# Altium schematic sheet FMC.SchDoc: FPGA Peripherals Board - FMC
size A3; Author: mayerph; DrawnBy: mayerph; Organization: IIS; Revision: PA; SheetNumber: 2; SheetTotal: 7
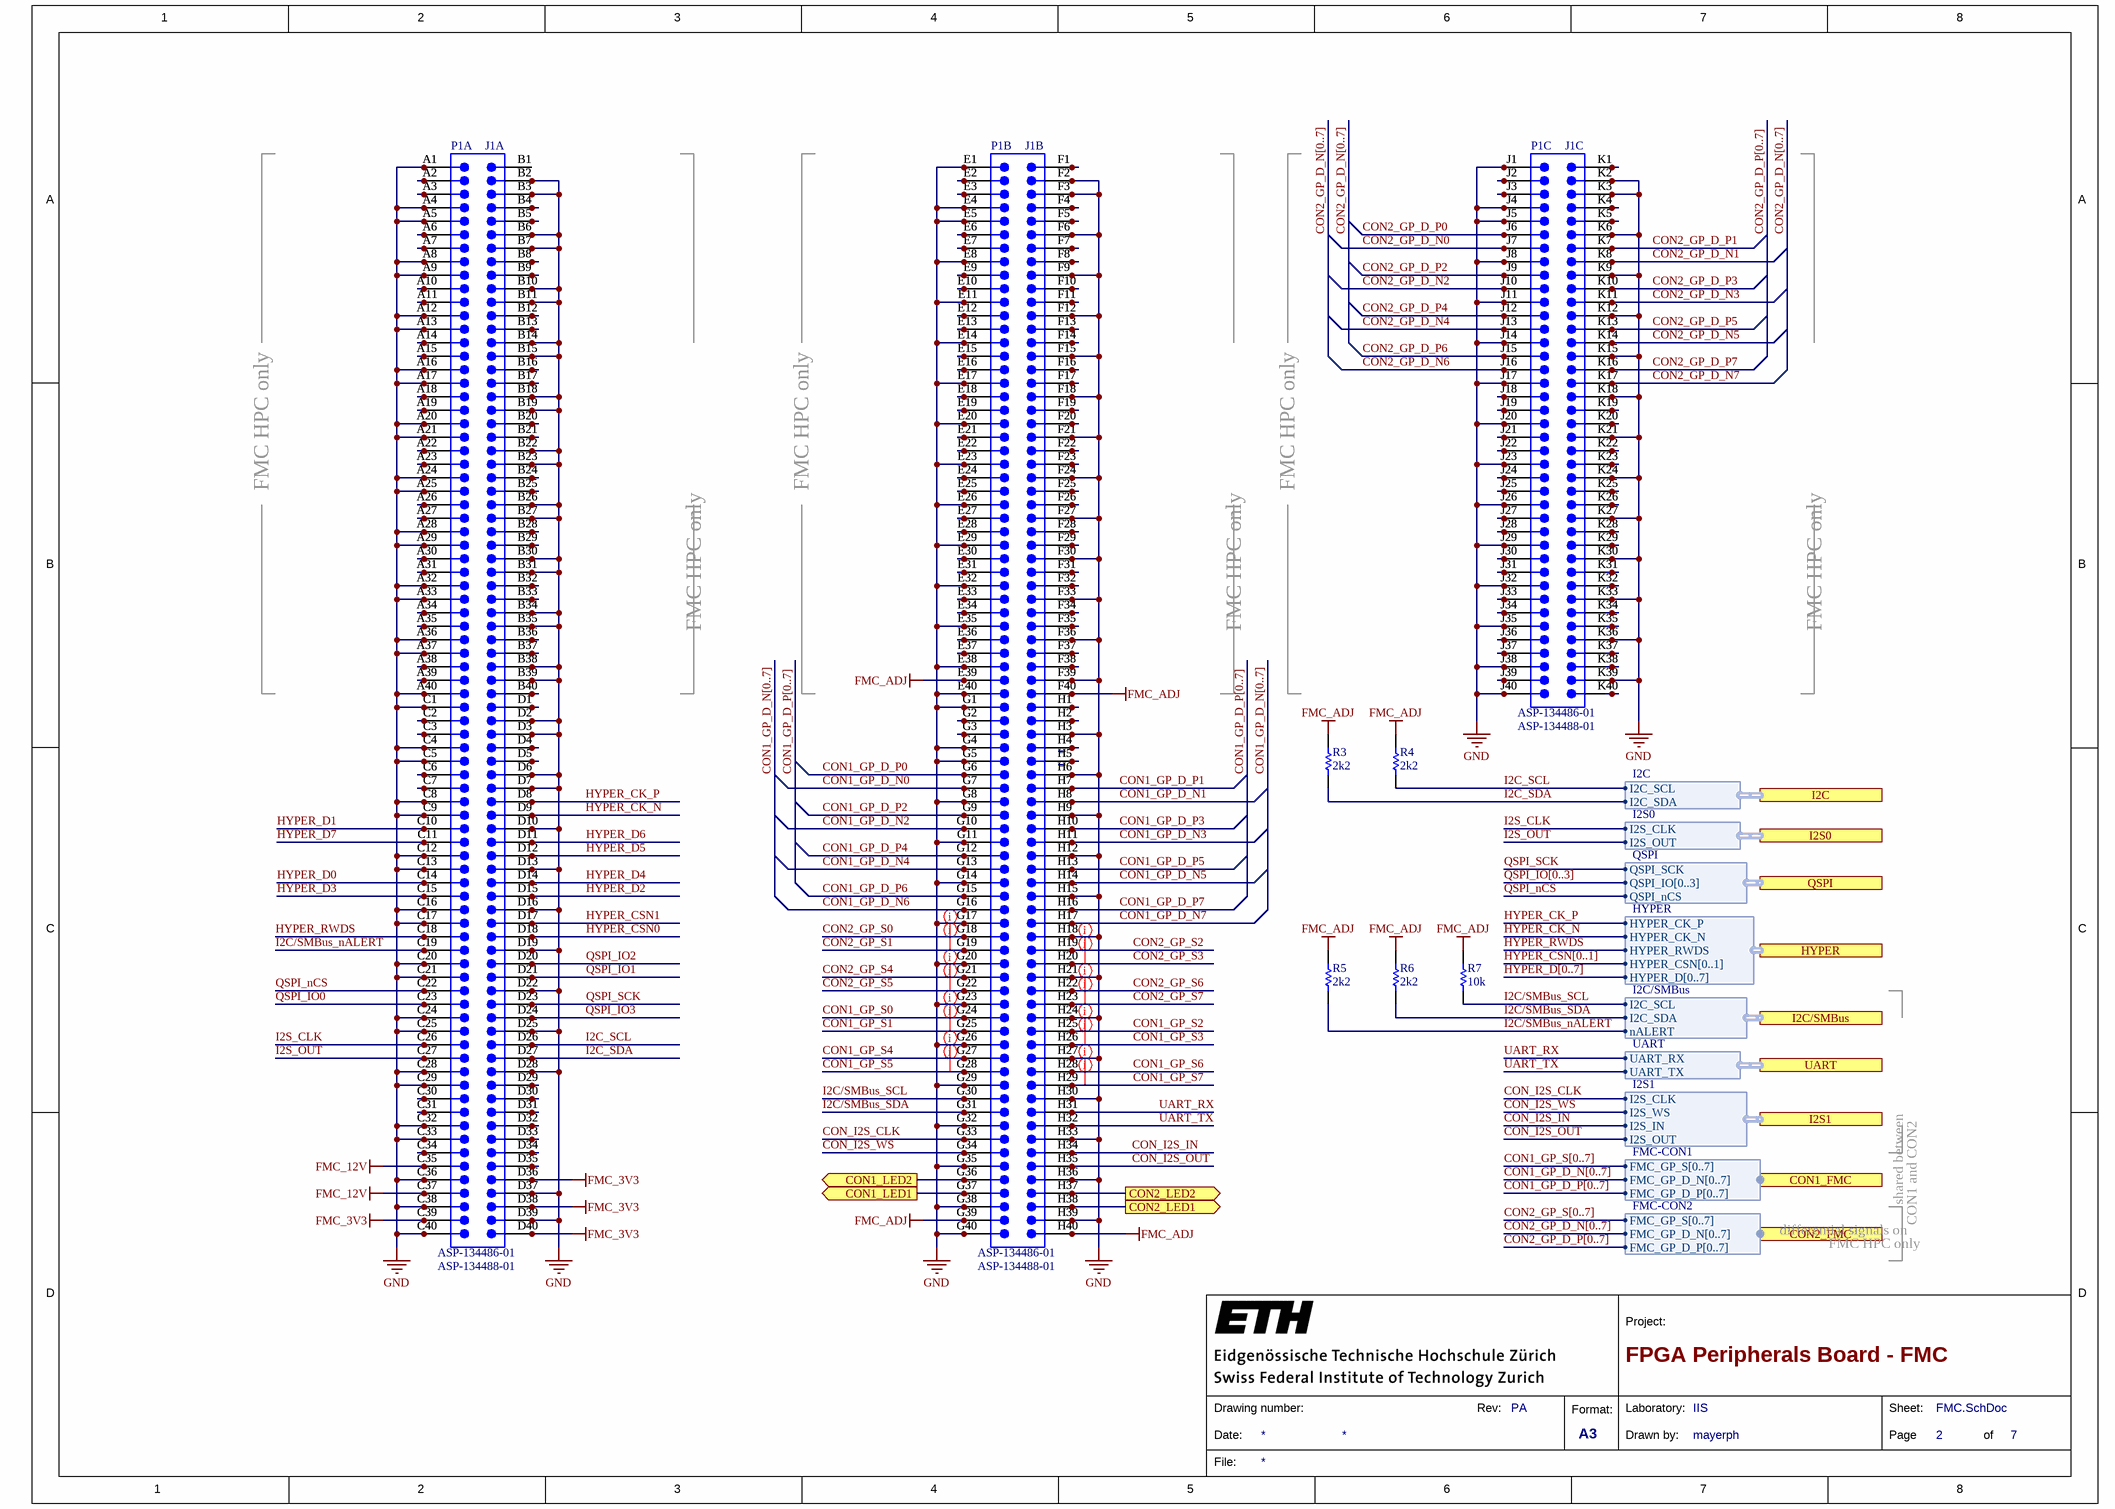
[diagram p0: FMC.SchDoc]

## Parts
J1  ASP-134486-01  [BTB-SM1-27-2V400F]  (parts A,B,C of 3)
P1  ASP-134488-01  [BTB-SM1-27-2V400M]  (parts A,B,C of 3)
R3  2k2  [RESC1005X40X25LL05T10]
R4  2k2  [RESC1005X40X25LL05T10]
R5  2k2  [RESC1005X40X25LL05T10]
R6  2k2  [RESC1005X40X25LL05T10]
R7  10k  [RESC1005X40X25LL05T10]

## Ports
CON1_FMC (harness FMC-CON1), CON1_LED1 (out), CON1_LED2 (out), CON2_FMC (harness FMC-CON2), CON2_LED1 (out), CON2_LED2 (out), HYPER (harness HYPER), I2C (harness I2C), I2C/SMBus (harness I2C/SMBus), I2S0 (harness I2S0), I2S1 (harness I2S1), QSPI (harness QSPI), UART (harness UART)

## Harnesses
I2C/SMBus: I2C_SDA, I2C_SCL, nALERT
UART: UART_TX, UART_RX
I2S1: I2S_OUT, I2S_IN, I2S_WS, I2S_CLK
FMC-CON1: FMC_GP_D_N[0..7], FMC_GP_S[0..7], FMC_GP_D_P[0..7]
I2S0: I2S_OUT, I2S_CLK
I2C: I2C_SDA, I2C_SCL
QSPI: QSPI_SCK, QSPI_IO[0..3], QSPI_nCS
HYPER: HYPER_CK_N, HYPER_CK_P, HYPER_RWDS, HYPER_CSN[0..1], HYPER_D[0..7]
FMC-CON2: FMC_GP_D_N[0..7], FMC_GP_S[0..7], FMC_GP_D_P[0..7]

## Nets
FMC_3V3: J1.C39 J1.D36 J1.D38 J1.D40 P1.C39 P1.D36 P1.D38 P1.D40
FMC_12V: J1.C35 J1.C37 P1.C35 P1.C37
FMC_ADJ: J1.E39 J1.F40 J1.G39 J1.H40 P1.E39 P1.F40 P1.G39 P1.H40 R3.2 R4.2 R5.2 R6.2 R7.2
GND: J1.A1 J1.A4 J1.A5 J1.A8 J1.A9 J1.A12 J1.A13 J1.A16 J1.A17 J1.A20 J1.A21 J1.A24 J1.A25 J1.A28 J1.A29 J1.A32 J1.A33 J1.A36 J1.A37 J1.A40 J1.B2 J1.B3 J1.B6 J1.B7 J1.B10 J1.B11 J1.B14 J1.B15 J1.B18 J1.B19 J1.B22 J1.B23 J1.B26 J1.B27 J1.B30 J1.B31 J1.B34 J1.B35 J1.B38 J1.B39 J1.C1 J1.C4 J1.C5 J1.C8 J1.C9 J1.C12 J1.C13 J1.C16 J1.C17 J1.C20 J1.C21 J1.C24 J1.C25 J1.C28 J1.C29 J1.C32 J1.C33 J1.C36 J1.C38 J1.C40 J1.D2 J1.D3 J1.D6 J1.D7 J1.D10 J1.D13 J1.D16 J1.D19 J1.D22 J1.D25 J1.D28 J1.D37 J1.D39 J1.E1 J1.E4 J1.E5 J1.E8 J1.E11 J1.E14 J1.E17 J1.E20 J1.E23 J1.E26 J1.E29 J1.E32 J1.E35 J1.E38 J1.E40 J1.F2 J1.F3 J1.F6 J1.F9 J1.F12 J1.F15 J1.F18 J1.F21 J1.F24 J1.F27 J1.F30 J1.F33 J1.F36 J1.F39 J1.G1 J1.G4 J1.G5 J1.G8 J1.G11 J1.G14 J1.G17 J1.G20 J1.G23 J1.G26 J1.G29 J1.G32 J1.G35 J1.G38 J1.G40 J1.H3 J1.H6 J1.H9 J1.H12 J1.H15 J1.H18 J1.H21 J1.H24 J1.H27 J1.H30 J1.H33 J1.H36 J1.H39 J1.J1 J1.J4 J1.J5 J1.J8 J1.J11 J1.J14 J1.J17 J1.J20 J1.J23 J1.J26 J1.J29 J1.J32 J1.J35 J1.J38 J1.J40 J1.K2 J1.K3 J1.K6 J1.K9 J1.K12 J1.K15 J1.K18 J1.K21 J1.K24 J1.K27 J1.K30 J1.K33 J1.K36 J1.K39 P1.A1 P1.A4 P1.A5 P1.A8 P1.A9 P1.A12 P1.A13 P1.A16 P1.A17 P1.A20 P1.A21 P1.A24 P1.A25 P1.A28 P1.A29 P1.A32 P1.A33 P1.A36 P1.A37 P1.A40 P1.B2 P1.B3 P1.B6 P1.B7 P1.B10 P1.B11 P1.B14 P1.B15 P1.B18 P1.B19 P1.B22 P1.B23 P1.B26 P1.B27 P1.B30 P1.B31 P1.B34 P1.B35 P1.B38 P1.B39 P1.C1 P1.C4 P1.C5 P1.C8 P1.C9 P1.C12 P1.C13 P1.C16 P1.C17 P1.C20 P1.C21 P1.C24 P1.C25 P1.C28 P1.C29 P1.C32 P1.C33 P1.C36 P1.C38 P1.C40 P1.D2 P1.D3 P1.D6 P1.D7 P1.D10 P1.D13 P1.D16 P1.D19 P1.D22 P1.D25 P1.D28 P1.D37 P1.D39 P1.E1 P1.E4 P1.E5 P1.E8 P1.E11 P1.E14 P1.E17 P1.E20 P1.E23 P1.E26 P1.E29 P1.E32 P1.E35 P1.E38 P1.E40 P1.F2 P1.F3 P1.F6 P1.F9 P1.F12 P1.F15 P1.F18 P1.F21 P1.F24 P1.F27 P1.F30 P1.F33 P1.F36 P1.F39 P1.G1 P1.G4 P1.G5 P1.G8 P1.G11 P1.G14 P1.G17 P1.G20 P1.G23 P1.G26 P1.G29 P1.G32 P1.G35 P1.G38 P1.G40 P1.H3 P1.H6 P1.H9 P1.H12 P1.H15 P1.H18 P1.H21 P1.H24 P1.H27 P1.H30 P1.H33 P1.H36 P1.H39 P1.J1 P1.J4 P1.J5 P1.J8 P1.J11 P1.J14 P1.J17 P1.J20 P1.J23 P1.J26 P1.J29 P1.J32 P1.J35 P1.J38 P1.J40 P1.K2 P1.K3 P1.K6 P1.K9 P1.K12 P1.K15 P1.K18 P1.K21 P1.K24 P1.K27 P1.K30 P1.K33 P1.K36 P1.K39
CON1_GP_D_N0: J1.G7 P1.G7
CON1_GP_D_N1: J1.H8 P1.H8
CON1_GP_D_N2: J1.G10 P1.G10
CON1_GP_D_N3: J1.H11 P1.H11
CON1_GP_D_N4: J1.G13 P1.G13
CON1_GP_D_N5: J1.H14 P1.H14
CON1_GP_D_N6: J1.G16 P1.G16
CON1_GP_D_N7: J1.H17 P1.H17
CON1_GP_D_P0: J1.G6 P1.G6
CON1_GP_D_P1: J1.H7 P1.H7
CON1_GP_D_P2: J1.G9 P1.G9
CON1_GP_D_P3: J1.H10 P1.H10
CON1_GP_D_P4: J1.G12 P1.G12
CON1_GP_D_P5: J1.H13 P1.H13
CON1_GP_D_P6: J1.G15 P1.G15
CON1_GP_D_P7: J1.H16 P1.H16
CON1_GP_S0: J1.G24 P1.G24
CON1_GP_S1: J1.G25 P1.G25
CON1_GP_S2: J1.H25 P1.H25
CON1_GP_S3: J1.H26 P1.H26
CON1_GP_S4: J1.G27 P1.G27
CON1_GP_S5: J1.G28 P1.G28
CON1_GP_S6: J1.H28 P1.H28
CON1_GP_S7: J1.H29 P1.H29
CON1_LED1: J1.G37 P1.G37 ; port CON1_LED1
CON1_LED2: J1.G36 P1.G36 ; port CON1_LED2
CON2_GP_D_N0: J1.J7 P1.J7
CON2_GP_D_N1: J1.K8 P1.K8
CON2_GP_D_N2: J1.J10 P1.J10
CON2_GP_D_N3: J1.K11 P1.K11
CON2_GP_D_N4: J1.J13 P1.J13
CON2_GP_D_N5: J1.K14 P1.K14
CON2_GP_D_N6: J1.J16 P1.J16
CON2_GP_D_N7: J1.K17 P1.K17
CON2_GP_D_P0: J1.J6 P1.J6
CON2_GP_D_P1: J1.K7 P1.K7
CON2_GP_D_P2: J1.J9 P1.J9
CON2_GP_D_P3: J1.K10 P1.K10
CON2_GP_D_P4: J1.J12 P1.J12
CON2_GP_D_P5: J1.K13 P1.K13
CON2_GP_D_P6: J1.J15 P1.J15
CON2_GP_D_P7: J1.K16 P1.K16
CON2_GP_S0: J1.G18 P1.G18
CON2_GP_S1: J1.G19 P1.G19
CON2_GP_S2: J1.H19 P1.H19
CON2_GP_S3: J1.H20 P1.H20
CON2_GP_S4: J1.G21 P1.G21
CON2_GP_S5: J1.G22 P1.G22
CON2_GP_S6: J1.H22 P1.H22
CON2_GP_S7: J1.H23 P1.H23
CON2_LED1: J1.H38 P1.H38 ; port CON2_LED1
CON2_LED2: J1.H37 P1.H37 ; port CON2_LED2
CON_I2S_CLK: J1.G33 P1.G33 ; port I2S1.I2S_CLK
CON_I2S_IN: J1.H34 P1.H34 ; port I2S1.I2S_IN
CON_I2S_OUT: J1.H35 P1.H35 ; port I2S1.I2S_OUT
CON_I2S_WS: J1.G34 P1.G34 ; port I2S1.I2S_WS
HYPER_CK_N: J1.D9 P1.D9 ; port HYPER.HYPER_CK_N
HYPER_CK_P: J1.D8 P1.D8 ; port HYPER.HYPER_CK_P
HYPER_CSN0: J1.D18 P1.D18
HYPER_CSN1: J1.D17 P1.D17
HYPER_D0: J1.C14 P1.C14
HYPER_D1: J1.C10 P1.C10
HYPER_D2: J1.D15 P1.D15
HYPER_D3: J1.C15 P1.C15
HYPER_D4: J1.D14 P1.D14
HYPER_D5: J1.D12 P1.D12
HYPER_D6: J1.D11 P1.D11
HYPER_D7: J1.C11 P1.C11
HYPER_RWDS: J1.C18 P1.C18 ; port HYPER.HYPER_RWDS
I2C/SMBus_nALERT: J1.C19 P1.C19 R5.1 ; port I2C/SMBus.nALERT
I2C/SMBus_SCL: J1.G30 P1.G30 R7.1 ; port I2C/SMBus.I2C_SCL
I2C/SMBus_SDA: J1.G31 P1.G31 R6.1 ; port I2C/SMBus.I2C_SDA
I2C_SCL: J1.D26 P1.D26 R4.1 ; port I2C.I2C_SCL
I2C_SDA: J1.D27 P1.D27 R3.1 ; port I2C.I2C_SDA
I2S_CLK: J1.C26 P1.C26 ; port I2S0.I2S_CLK
I2S_OUT: J1.C27 P1.C27 ; port I2S0.I2S_OUT
QSPI_IO0: J1.C23 P1.C23
QSPI_IO1: J1.D21 P1.D21
QSPI_IO2: J1.D20 P1.D20
QSPI_IO3: J1.D24 P1.D24
QSPI_nCS: J1.C22 P1.C22 ; port QSPI.QSPI_nCS
QSPI_SCK: J1.D23 P1.D23 ; port QSPI.QSPI_SCK
UART_RX: J1.H31 P1.H31 ; port UART.UART_RX
UART_TX: J1.H32 P1.H32 ; port UART.UART_TX
NetJ1_A2: J1.A2 P1.A2
NetJ1_A3: J1.A3 P1.A3
NetJ1_A6: J1.A6 P1.A6
NetJ1_A7: J1.A7 P1.A7
NetJ1_A10: J1.A10 P1.A10
NetJ1_A11: J1.A11 P1.A11
NetJ1_A14: J1.A14 P1.A14
NetJ1_A15: J1.A15 P1.A15
NetJ1_A18: J1.A18 P1.A18
NetJ1_A19: J1.A19 P1.A19
NetJ1_A22: J1.A22 P1.A22
NetJ1_A23: J1.A23 P1.A23
NetJ1_A26: J1.A26 P1.A26
NetJ1_A27: J1.A27 P1.A27
NetJ1_A30: J1.A30 P1.A30
NetJ1_A31: J1.A31 P1.A31
NetJ1_A34: J1.A34 P1.A34
NetJ1_A35: J1.A35 P1.A35
NetJ1_A38: J1.A38 P1.A38
NetJ1_A39: J1.A39 P1.A39
NetJ1_B1: J1.B1 P1.B1
NetJ1_B4: J1.B4 P1.B4
NetJ1_B5: J1.B5 P1.B5
NetJ1_B8: J1.B8 P1.B8
NetJ1_B9: J1.B9 P1.B9
NetJ1_B12: J1.B12 P1.B12
NetJ1_B13: J1.B13 P1.B13
NetJ1_B16: J1.B16 P1.B16
NetJ1_B17: J1.B17 P1.B17
NetJ1_B20: J1.B20 P1.B20
NetJ1_B21: J1.B21 P1.B21
NetJ1_B24: J1.B24 P1.B24
NetJ1_B25: J1.B25 P1.B25
NetJ1_B28: J1.B28 P1.B28
NetJ1_B29: J1.B29 P1.B29
NetJ1_B32: J1.B32 P1.B32
NetJ1_B33: J1.B33 P1.B33
NetJ1_B36: J1.B36 P1.B36
NetJ1_B37: J1.B37 P1.B37
NetJ1_B40: J1.B40 P1.B40
NetJ1_C2: J1.C2 P1.C2
NetJ1_C3: J1.C3 P1.C3
NetJ1_C6: J1.C6 P1.C6
NetJ1_C7: J1.C7 P1.C7
NetJ1_C30: J1.C30 P1.C30
NetJ1_C31: J1.C31 P1.C31
NetJ1_C34: J1.C34 P1.C34
NetJ1_D1: J1.D1 P1.D1
NetJ1_D4: J1.D4 P1.D4
NetJ1_D5: J1.D5 P1.D5
NetJ1_D29: J1.D29 P1.D29
NetJ1_D30: J1.D30 P1.D30
NetJ1_D31: J1.D31 P1.D31
NetJ1_D32: J1.D32 P1.D32
NetJ1_D33: J1.D33 P1.D33
NetJ1_D34: J1.D34 P1.D34
NetJ1_D35: J1.D35 P1.D35
NetJ1_E2: J1.E2 P1.E2
NetJ1_E3: J1.E3 P1.E3
NetJ1_E6: J1.E6 P1.E6
NetJ1_E7: J1.E7 P1.E7
NetJ1_E9: J1.E9 P1.E9
NetJ1_E10: J1.E10 P1.E10
NetJ1_E12: J1.E12 P1.E12
NetJ1_E13: J1.E13 P1.E13
NetJ1_E15: J1.E15 P1.E15
NetJ1_E16: J1.E16 P1.E16
NetJ1_E18: J1.E18 P1.E18
NetJ1_E19: J1.E19 P1.E19
NetJ1_E21: J1.E21 P1.E21
NetJ1_E22: J1.E22 P1.E22
NetJ1_E24: J1.E24 P1.E24
NetJ1_E25: J1.E25 P1.E25
NetJ1_E27: J1.E27 P1.E27
NetJ1_E28: J1.E28 P1.E28
NetJ1_E30: J1.E30 P1.E30
NetJ1_E31: J1.E31 P1.E31
NetJ1_E33: J1.E33 P1.E33
NetJ1_E34: J1.E34 P1.E34
NetJ1_E36: J1.E36 P1.E36
NetJ1_E37: J1.E37 P1.E37
NetJ1_F1: J1.F1 P1.F1
NetJ1_F4: J1.F4 P1.F4
NetJ1_F5: J1.F5 P1.F5
NetJ1_F7: J1.F7 P1.F7
NetJ1_F8: J1.F8 P1.F8
NetJ1_F10: J1.F10 P1.F10
NetJ1_F11: J1.F11 P1.F11
NetJ1_F13: J1.F13 P1.F13
NetJ1_F14: J1.F14 P1.F14
NetJ1_F16: J1.F16 P1.F16
NetJ1_F17: J1.F17 P1.F17
NetJ1_F19: J1.F19 P1.F19
NetJ1_F20: J1.F20 P1.F20
NetJ1_F22: J1.F22 P1.F22
NetJ1_F23: J1.F23 P1.F23
NetJ1_F25: J1.F25 P1.F25
NetJ1_F26: J1.F26 P1.F26
NetJ1_F28: J1.F28 P1.F28
NetJ1_F29: J1.F29 P1.F29
NetJ1_F31: J1.F31 P1.F31
NetJ1_F32: J1.F32 P1.F32
NetJ1_F34: J1.F34 P1.F34
NetJ1_F35: J1.F35 P1.F35
NetJ1_F37: J1.F37 P1.F37
NetJ1_F38: J1.F38 P1.F38
NetJ1_G2: J1.G2 P1.G2
NetJ1_G3: J1.G3 P1.G3
NetJ1_H1: J1.H1 P1.H1
NetJ1_H2: J1.H2 P1.H2
NetJ1_H4: J1.H4 P1.H4
NetJ1_H5: J1.H5 P1.H5
NetJ1_J2: J1.J2 P1.J2
NetJ1_J3: J1.J3 P1.J3
NetJ1_J18: J1.J18 P1.J18
NetJ1_J19: J1.J19 P1.J19
NetJ1_J21: J1.J21 P1.J21
NetJ1_J22: J1.J22 P1.J22
NetJ1_J24: J1.J24 P1.J24
NetJ1_J25: J1.J25 P1.J25
NetJ1_J27: J1.J27 P1.J27
NetJ1_J28: J1.J28 P1.J28
NetJ1_J30: J1.J30 P1.J30
NetJ1_J31: J1.J31 P1.J31
NetJ1_J33: J1.J33 P1.J33
NetJ1_J34: J1.J34 P1.J34
NetJ1_J36: J1.J36 P1.J36
NetJ1_J37: J1.J37 P1.J37
NetJ1_J39: J1.J39 P1.J39
NetJ1_K1: J1.K1 P1.K1
NetJ1_K4: J1.K4 P1.K4
NetJ1_K5: J1.K5 P1.K5
NetJ1_K19: J1.K19 P1.K19
NetJ1_K20: J1.K20 P1.K20
NetJ1_K22: J1.K22 P1.K22
NetJ1_K23: J1.K23 P1.K23
NetJ1_K25: J1.K25 P1.K25
NetJ1_K26: J1.K26 P1.K26
NetJ1_K28: J1.K28 P1.K28
NetJ1_K29: J1.K29 P1.K29
NetJ1_K31: J1.K31 P1.K31
NetJ1_K32: J1.K32 P1.K32
NetJ1_K34: J1.K34 P1.K34
NetJ1_K35: J1.K35 P1.K35
NetJ1_K37: J1.K37 P1.K37
NetJ1_K38: J1.K38 P1.K38
NetJ1_K40: J1.K40 P1.K40

## Buses and harness runs
bus CON1_GP_D_N[0..7]
bus CON1_GP_D_P[0..7]
bus CON1_GP_S[0..7]
bus CON2_GP_D_N[0..7]
bus CON2_GP_D_P[0..7]
bus CON2_GP_S[0..7]
bus HYPER_CSN[0..1]
bus HYPER_D[0..7]
bus QSPI_IO[0..3]

## Layout directives
net class S_FMC_MPP_CON2: CON2_GP_S0, CON2_GP_S1, CON2_GP_S2, CON2_GP_S3, CON2_GP_S4, CON2_GP_S5, CON2_GP_S6, CON2_GP_S7
net class S_FMC_MPP_CON1: CON1_GP_S0, CON1_GP_S1, CON1_GP_S2, CON1_GP_S3, CON1_GP_S4, CON1_GP_S5, CON1_GP_S6, CON1_GP_S7

## Notes on the sheet
- FMC HPC only
- shared between
- CON1 and CON2
- differential signals on
- 1
- 2
- 3
- 4
- 5
- 6
- 7
- 8
- A
- B
- C
- D
- Project:
- Date:
- Drawing number:
- Rev:
- Format:
- A3
- Drawn by:
- Laboratory:
- Page
- Sheet:
- of
- File:

## Library data of the parts
J1 = CMP-0001-00082-1: Board-to-Board Connector, Vertical, 10-Row, Pitch 1.27mm, 400-Position, Female; Manufacturer: Samtec; Mating Connector: ASP-134488-01; Description: SAMTEC - ASP-134486-01 - Board-To-Board Connector, Vita 57 XMC, 1.27 mm, 400 Contacts, Receptacle, ASP Series, Surface Mount; Number of Contacts: 400; Gender: Receptacle; Publisher: Altium; Component Kind: Standard; Package Reference: BTB-SM1-27-2V400F; Datasheet Version: May-2008; ClassName: Board Template Connector; PartId: 1; Supplier 1: Digi-Key; Supplier Part Number 1: SAM8728CT-ND; Manufacturer Part Number: ASP-134486-01; RoHS: Yes; Category: Board to Board Connectors; Stock 1: 2693; Pricing 1: 1=27.42000, 10=24.74900, 25=23.71200, 50=22.23000, 100=21.48900 (USD); Mount: Surface Mount; Contact Plating: Gold; Contact Material: Copper Alloy; Housing Color: Black; Number of Rows: 10; Packaging: Tape and Reel; Termination: Solder; Number of Positions: 400; Orientation: Straight; Series: ASP; Pitch: 1.27mm; Depth: 13.23mm; Radiation Hardening: No; REACH SVHC: No SVHC; RoHS Compliant: Yes; ComponentLink1URL: https://datasheet.ciiva.com/26877/getdatasheetpartid-699855-26877302.pdf?src-supplier=Verical; ComponentLink1Description: https://datasheet.ciiva.com/26877/getdatasheetpartid-699855-26877302.pdf?src-supplier=Verical
P1 = CMP-0001-00022-1: Board-to-Board Connector, Vertical, 10-Row, Pitch 1.27mm, 400-Position; Manufacturer: Samtec; Mating Connector: ASP-134486-01; Description: SAMTEC - ASP-134488-01 - Board-To-Board Connector, 1.27 mm, 400 Contacts, Header, ASP Series, Surface Mount, 10 Rows; Number of Contacts: 400; Gender: Male; Pitch: 0.05inch; Publisher: Altium; ClassName: Board Template Connector; Component Kind: Standard; Datasheet Version: Feb-2007; Package Reference: BTB-SM1-27-2V400M; PartId: 1; Supplier 1: Digi-Key; Supplier Part Number 1: SAM8730-ND; Manufacturer Part Number: ASP-134488-01; RoHS: Yes; Category: Connectors; Stock 1: 4276; Pricing 1: 1=27.73000, 10=25.03300, 25=23.98400, 50=22.48500, 100=21.73550, 250=20.53632, 500=19.93670, 1000=19.48700 (USD); Mount: Surface Mount; Contact Plating: Gold; Contact Material: Copper Alloy; Number of Rows: 10; Termination: SMD/SMT; Packaging: Tape and Reel; Number of Positions: 400; Series: ASP; Package Quantity: 1; Radiation Hardening: No; REACH SVHC: No SVHC; RoHS Compliant: Yes; ComponentLink1URL: https://datasheet.ciiva.com/403/asp-134488-01-403749.pdf?src-supplier=Digi-Key; ComponentLink1Description: https://datasheet.ciiva.com/403/asp-134488-01-403749.pdf?src-supplier=Digi-Key; ComponentLink2URL: https://datasheet.ciiva.com/9532/asp-134488-01-9532666.pdf?src-supplier=Avnet; ComponentLink2Description: https://datasheet.ciiva.com/9532/asp-134488-01-9532666.pdf?src-supplier=Avnet
R3-R6 = CMP-2002-07567-1: Manufacturer: Yageo / Phycomp; Part Number: RC0402FR-072K2L; Value: 2.2 kOhm; Tolerance: 1%; Temperature Coefficient: 100ppm/°C; Max Power Dissipation: 63mW; Voltage Rating: 50V; Supplier 1: Digi-Key; Supplier Part Number 1: 311-2.20KLRCT-ND; Manufacturer Part Number: RC0402FR-072K2L; RoHS: Yes; Category: Chip SMD Resistors; Stock 1: 3865260; Pricing 1: 1=0.10000, 10=0.01400, 100=0.00580, 1000=0.00260, 2500=0.00226, 5000=0.00186 (USD); Case/Package: 0402; Case Code (Imperial): 0402; Case Code (Metric): 1005; Weight: 2.3E-05oz; Size Code: 0402; Min Operating Temperature: -55°C; Max Operating Temperature: 155°C; Packaging: Tape and Reel; Resistor Type: Thick Film; Series: RC; Power Rating: 63mW; Number of Terminations: 2; Termination: SMD/SMT; Resistance Tolerance: 1%; Features: Moisture Resistant; Construction: Rectangular; Technology: THICK FILM; Length: 1mm; Width: 0.5mm; Height: 0.35mm; Depth: 0.5mm; RoHS Compliant: Yes; REACH SVHC: Unknown; Lead Free: Lead Free; Military Standard: Not; ComponentLink1URL: https://datasheet.ciiva.com/11808/0900766b80c66297-11808786.pdf?src-supplier=RSComponents; ComponentLink1Description: https://datasheet.ciiva.com/11808/0900766b80c66297-11808786.pdf?src-supplier=RSComponents; ComponentLink2URL: https://datasheet.ciiva.com/12577/pyu-rc0402-51-rohs-l-6-r-12577429.pdf?src-supplier=Mouser; ComponentLink2Description: https://datasheet.ciiva.com/12577/pyu-rc0402-51-rohs-l-6-r-12577429.pdf?src-supplier=Mouser; ComponentLink3URL: https://datasheet.ciiva.com/16741/pyu-rc0402-51-rohs-l-6-r-16741015.pdf?src-supplier=Future+Electronics; ComponentLink3Description: https://datasheet.ciiva.com/16741/pyu-rc0402-51-rohs-l-6-r-16741015.pdf?src-supplier=Future+Electronics; ComponentLink4URL: https://datasheet.ciiva.com/7849/1018594-7849928.pdf?src-supplier=Element14; ComponentLink4Description: https://datasheet.ciiva.com/7849/1018594-7849928.pdf?src-supplier=Element14; ComponentLink5URL: https://datasheet.ciiva.com/7849/1018594-7849929.pdf?src-supplier=Element14; ComponentLink5Description: https://datasheet.ciiva.com/7849/1018594-7849929.pdf?src-supplier=Element14; ComponentLink6URL: https://datasheet.ciiva.com/7983/1018594-7983515.pdf?src-supplier=Element14; ComponentLink6Description: https://datasheet.ciiva.com/7983/1018594-7983515.pdf?src-supplier=Element14; ComponentLink7URL: https://datasheet.ciiva.com/46383/1018594-46383563.pdf?src-supplier=Element14; ComponentLink7Description: https://datasheet.ciiva.com/46383/1018594-46383563.pdf?src-supplier=Element14
R7 = CMP-2002-07353-1: Part Number: RC0402FR-0710KL; Manufacturer: Yageo / Phycomp; Value: 10 kOhm; Tolerance: 1%; Power Rating: 62.5mW; Max Power Dissipation: 63mW; Temperature Coefficient: 100ppm/°C; Voltage Rating: 50V; Supplier 1: Digi-Key; Supplier Part Number 1: 311-10.0KLRCT-ND; Manufacturer Part Number: RC0402FR-0710KL; RoHS: Yes; Category: Chip SMD Resistors; Stock 1: 39342268; Pricing 1: 1=0.10000, 10=0.01400, 100=0.00580, 1000=0.00260, 2500=0.00226, 5000=0.00186 (USD); Case/Package: 0402; Number of Pins: 2; Case Code (Imperial): 0402; Case Code (Metric): 1005; Min Operating Temperature: -55°C; Max Operating Temperature: 155°C; Packaging: Tape and Reel; Termination: SMD/SMT; Series: RC; Resistance Tolerance: 1%; Resistor Type: Thick Film; Number of Terminations: 2; Voltage Rating (DC): 50V; Construction: Rectangular; Features: Moisture Resistant; Working Voltage: 50V; Length: 1mm; Width: 0.5mm; Height: 0.32mm; Depth: 0.5mm; Lead Pitch: 0.2mm; RoHS Compliant: Yes; Lead Free: Lead Free; REACH SVHC: No SVHC; Military Standard: Not; ComponentLink1URL: https://datasheet.ciiva.com/7660/38568-7660787.pdf?src-supplier=Element14; ComponentLink1Description: https://datasheet.ciiva.com/7660/38568-7660787.pdf?src-supplier=Element14; ComponentLink2URL: https://datasheet.ciiva.com/7849/1784430-7849813.pdf?src-supplier=Element14; ComponentLink2Description: https://datasheet.ciiva.com/7849/1784430-7849813.pdf?src-supplier=Element14; ComponentLink3URL: https://datasheet.ciiva.com/7849/1686128-7849814.pdf?src-supplier=Element14; ComponentLink3Description: https://datasheet.ciiva.com/7849/1686128-7849814.pdf?src-supplier=Element14; ComponentLink4URL: https://datasheet.ciiva.com/7849/1784430-7849815.pdf?src-supplier=Element14; ComponentLink4Description: https://datasheet.ciiva.com/7849/1784430-7849815.pdf?src-supplier=Element14; ComponentLink5URL: https://datasheet.ciiva.com/22747/1018594-22747512.pdf?src-supplier=Element14; ComponentLink5Description: https://datasheet.ciiva.com/22747/1018594-22747512.pdf?src-supplier=Element14; ComponentLink6URL: https://datasheet.ciiva.com/12667/pyu-rc0402-51-rohs-l-6-r-12667067.pdf?src-supplier=Mouser; ComponentLink6Description: https://datasheet.ciiva.com/12667/pyu-rc0402-51-rohs-l-6-r-12667067.pdf?src-supplier=Mouser; ComponentLink7URL: https://datasheet.ciiva.com/7983/1018594-7983486.pdf?src-supplier=Element14; ComponentLink7Description: https://datasheet.ciiva.com/7983/1018594-7983486.pdf?src-supplier=Element14